# EAGLE design ipad3_lcd (EAGLE 6.2)
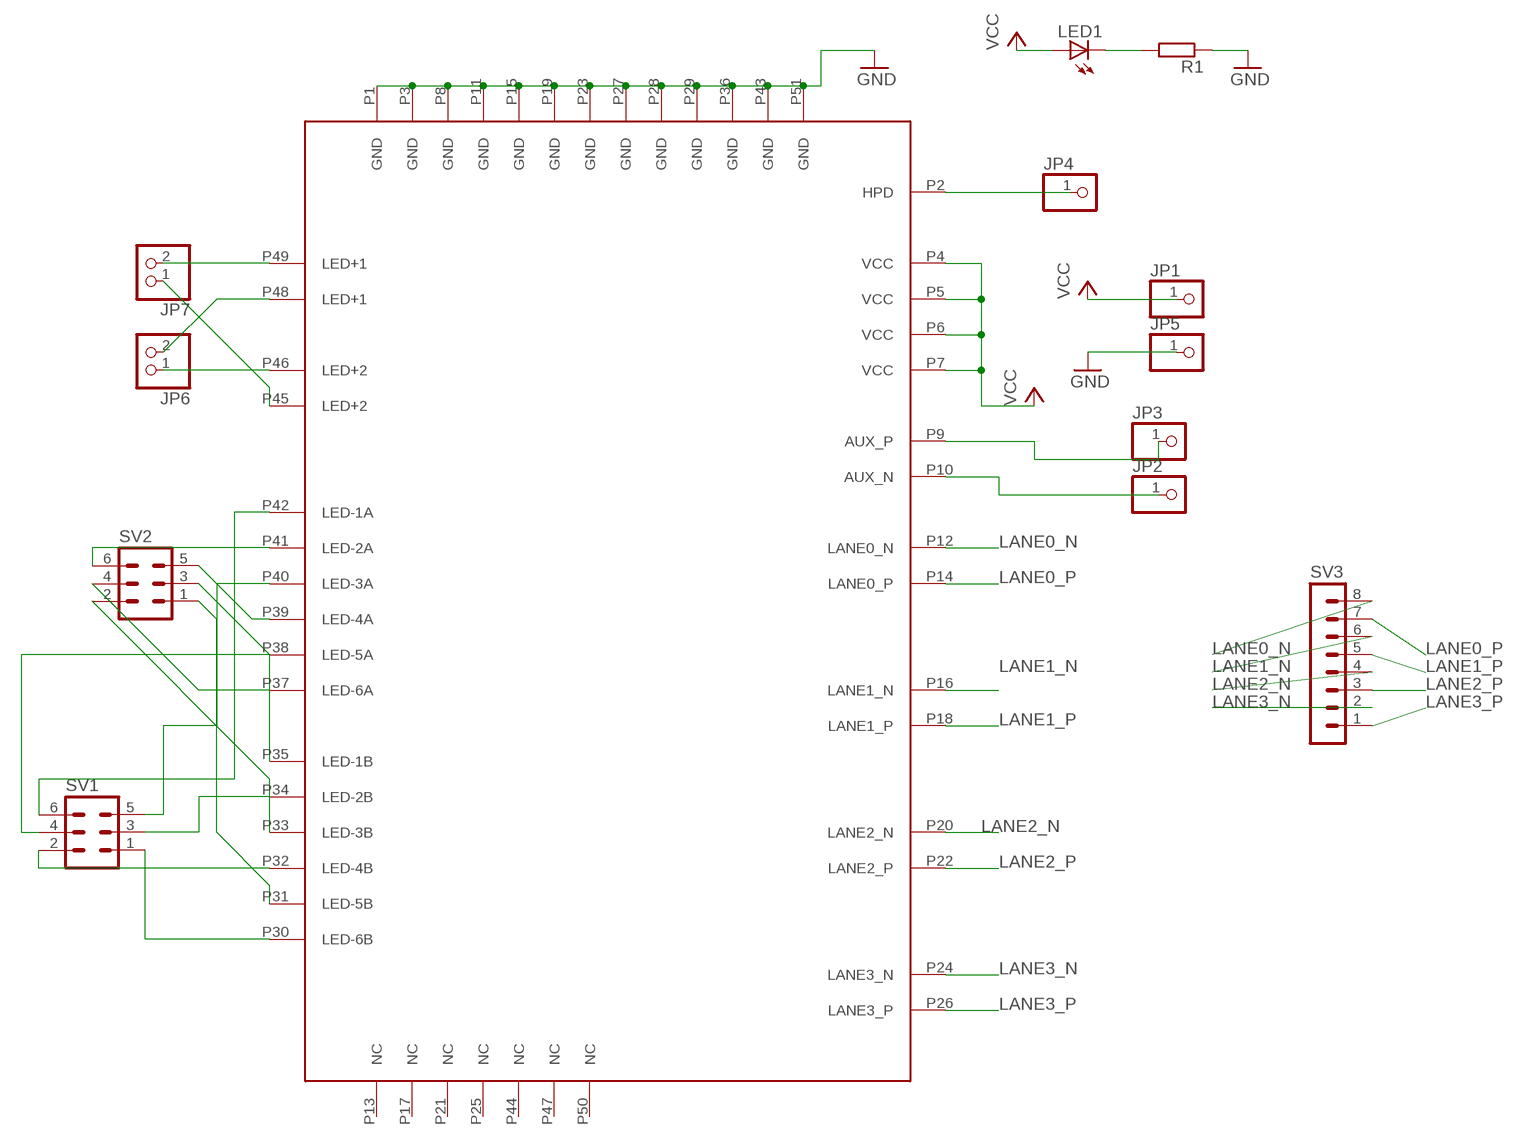
[diagram p0: schematic, sheet 1]

## Parts
JP1  PINHD-1X1  [1X01]
JP2  PINHD-1X1  [1X01]
JP3  PINHD-1X1  [1X01]
JP4  PINHD-1X1  [1X01]
JP5  PINHD-1X1  [1X01]
JP6  PINHD-1X2  [1X02]
JP7  PINHD-1X2  [1X02]
LED1  LEDCHIP-LED0805  [CHIP-LED0805]
R1  R-EU_M0805  [M0805]
SV1  MA03-2  [MA03-2]
SV2  MA03-2  [MA03-2]
SV3  MA08-1  [MA08-1]
U$1  IPAD3-CONN  [MOLEX502250-5191]

## Nets
AUX_N: JP2.1 U$1.P10(AUX_N)
AUX_P: JP3.1 U$1.P9(AUX_P)
GND: JP5.1 R1.1 U$1.P1(GND) U$1.P3(GND) U$1.P8(GND) U$1.P11(GND) U$1.P15(GND) U$1.P19(GND) U$1.P23(GND) U$1.P27(GND) U$1.P28(GND) U$1.P29(GND) U$1.P36(GND) U$1.P43(GND) U$1.P51(GND)
HPD: JP4.1 U$1.P2(HPD)
LANE0_N: SV3.8 U$1.P12(LANE0_N)
LANE0_P: SV3.7 U$1.P14(LANE0_P)
LANE1_N: SV3.6 U$1.P16(LANE1_N)
LANE1_P: SV3.5 U$1.P18(LANE1_P)
LANE2_N: SV3.4 U$1.P20(LANE2_N)
LANE2_P: SV3.3 U$1.P22(LANE2_P)
LANE3_N: SV3.2 U$1.P24(LANE3_N)
LANE3_P: SV3.1 U$1.P26(LANE3_P)
N$1: SV1.1 U$1.P30(LED-6B)
N$2: SV1.2 U$1.P32(LED-4B)
N$3: LED1.C R1.2
N$4: SV1.3 U$1.P34(LED-2B)
N$5: SV1.4 U$1.P38(LED-5A)
N$6: SV1.5 U$1.P40(LED-3A)
N$7: SV1.6 U$1.P42(LED-1A)
N$8: SV2.6 U$1.P41(LED-2A)
N$9: SV2.5 U$1.P39(LED-4A)
N$10: SV2.4 U$1.P37(LED-6A)
N$11: SV2.3 U$1.P35(LED-1B)
N$12: SV2.2 U$1.P33(LED-3B)
N$13: SV2.1 U$1.P31(LED-5B)
N$14: JP6.1 U$1.P46(LED+2)
N$15: JP6.2 U$1.P48(LED+1)
N$16: JP7.1 U$1.P45(LED+2)
N$17: JP7.2 U$1.P49(LED+1)
VCC: JP1.1 LED1.A U$1.P4(VCC) U$1.P5(VCC) U$1.P6(VCC) U$1.P7(VCC)
Unconnected: U$1.P13(NC) U$1.P17(NC) U$1.P21(NC) U$1.P25(NC) U$1.P44(NC) U$1.P47(NC) U$1.P50(NC)

## Library data of the parts
JP1-JP5 = pinhead:PINHD-1X1: PIN HEADER
JP6 JP7 = pinhead:PINHD-1X2: PIN HEADER
LED1 = led:LED: LED OSRAM: - CHIPLED LG R971, LG N971, LY N971, LG Q971, LY Q971, LO R971, LY R971 LH N974, LH R974 LS Q976, LO Q976, LY Q976 LO Q996 - Hyper CHIPLED LW Q18S LB Q993, LB Q99A, LB R99A - SideLED LS A670, LO A670, LY A670, LG A670, LP A670 LB A673, LV A673, LT A673, LW A673 LH A674 LY A675 LS A676, LA A676, LO A676, LY A676, LW A676 LS A679, LY A679, LG A679 - Hyper Micro SIDELED® LS Y876, LA Y876, LO Y876, LY Y876 LT Y87S - SmartLED LW L88C, LW L88S LB L89C, LB L89S, LG L890 LS L89K, LO L89K, LY L89K LS L896, LA L896, LO L896, LY L896 - TOPLED LS T670, LO T670, LY T670, LG T670, LP T670 LSG T670, LSP T670, LSY T670, LOP T670, LYG T670 LG T671, LOG T671, LSG T671 LB T673, LV T673, LT T673, LW T673 LH T674 LS T676, LA T676, LO T676, LY T676, LB T676, LH T676, LSB T676, LW T676 LB T67C, LV T67C, LT T67C, LS T67K, LO T67K, LY T67K, LW E67C LS E67B, LA E67B, LO E67B, LY E67B, LB E67C, LV E67C, LT E67C LW T67C LS T679, LY T679, LG T679 LS T770, LO T770, LY T770, LG T770, LP T770 LB T773, LV T773, LT T773, LW T773 LH T774 LS E675, LA E675, LY E675, LS T675 LS T776, LA T776, LO T776, LY T776, LB T776 LHGB T686 LT T68C, LB T68C - Hyper Mini TOPLED® LB M676 - Mini TOPLED Santana® LG M470 LS M47K, LO M47K, LY M47K Source: http://www.osram.convergy.de LUXEON: - LUMILED® LXK2-PW12-R00, LXK2-PW12-S00, LXK2-PW14-U00, LXK2-PW14-V00 LXK2-PM12-R00, LXK2-PM12-S00, LXK2-PM14-U00 LXK2-PE12-Q00, LXK2-PE12-R00, LXK2-PE12-S00, LXK2-PE14-T00, LXK2-PE14-U00 LXK2-PB12-K00, LXK2-PB12-L00, LXK2-PB12-M00, LXK2-PB14-N00, LXK2-PB14-P00, LXK2-PB14-Q00 LXK2-PR12-L00, LXK2-PR12-M00, LXK2-PR14-Q00, LXK2-PR14-R00 LXK2-PD12-Q00, LXK2-PD12-R00, LXK2-PD12-S00 LXK2-PH12-R00, LXK2-PH12-S00 LXK2-PL12-P00, LXK2-PL12-Q00, LXK2-PL12-R00 Source: www.luxeon.com KINGBRIGHT: KA-3528ASYC Source: www.kingbright.com
R1 = rcl:R-EU_: RESISTOR, European symbol
SV1 SV2 = con-lstb:MA03-2: PIN HEADER; OC_FARNELL: unknown; OC_NEWARK: unknown
SV3 = con-lstb:MA08-1: PIN HEADER; OC_FARNELL: unknown; OC_NEWARK: unknown
U$1 = con-ipad3:IPAD3-CONN

## Board
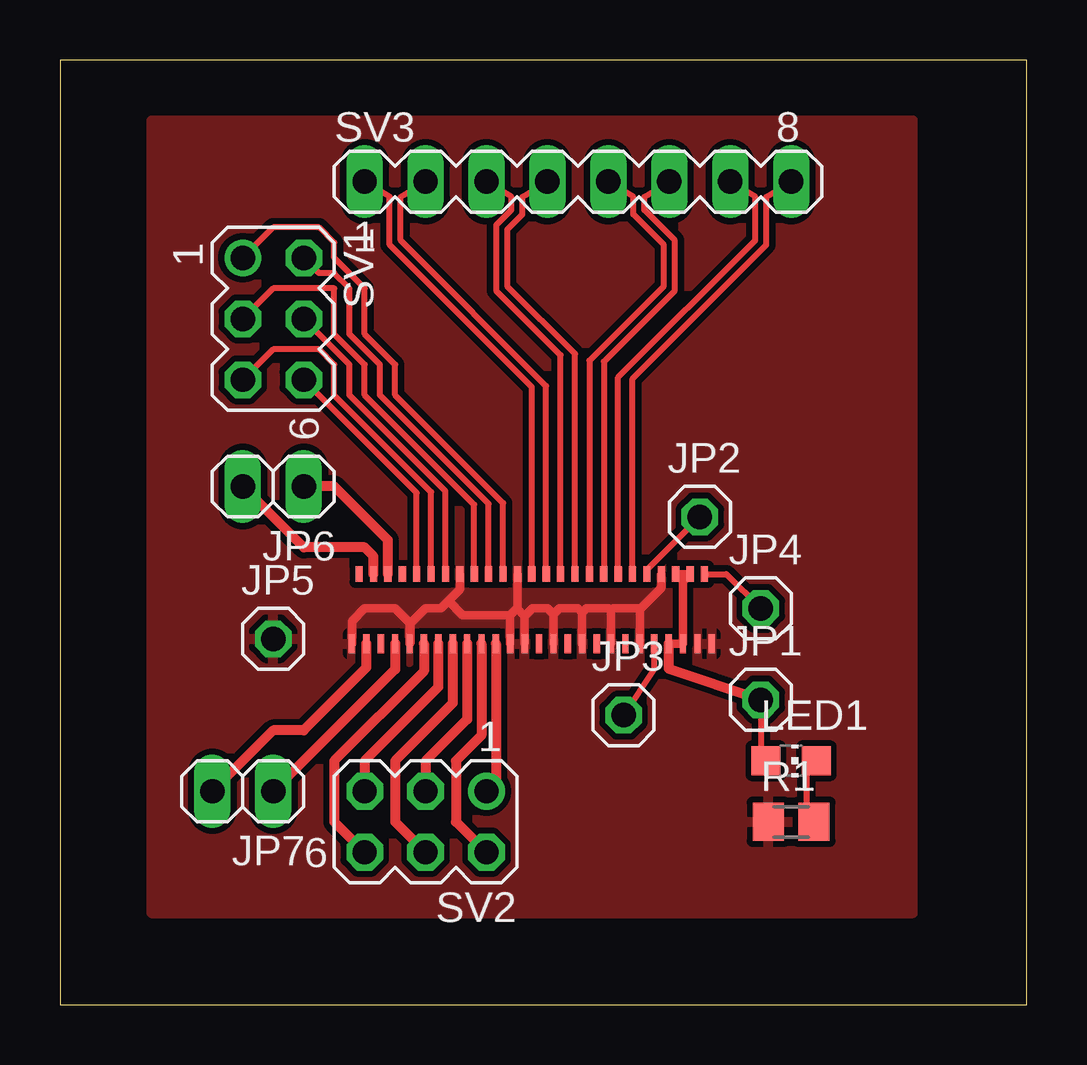
[diagram p1: board, top side]

Size 40.31 x 39.36 mm. Coordinates in mm from the lower left corner, seen from the top.
Outline: 0,0 40.31,0 40.31,39.36 0,39.36 0,0
Copper layers (1*16): Top 0.035mm / dielectric 1.5mm / Bottom 0.035mm
Design rules: minimum track width 10mil, minimum drill 24mil, track to track 8mil, track to pad 8mil, pad to pad 8mil, via to via 8mil, smd to smd 8mil, copper to edge 40mil, drill to drill 8mil, minimum pad ring 10mil, minimum via ring 8mil, stop-mask expansion 4mil, vias tented up to drill 0mil, thermal gap 10mil

### Footprints (pad centres in the part's own frame; a part is rotated, then mirrored left to right if it is on the bottom)
1X01 = drill 1.016 octagon: 1 0,0
1X02 = drill 1.016 long: 1 -1.27,0; 2 1.27,0
CHIP-LED0805 = smd 1.2 x 1.2: A 0,-1.05; C 0,1.05
M0805 = smd 1.3 x 1.6: 1 -0.95,0; 2 0.95,0
MA03-2 = drill 1.016: 1 -2.54,-1.27 | drill 1.016 octagon: 2 -2.54,1.27; 3 0,-1.27; 4 0,1.27; 5 2.54,-1.27; 6 2.54,1.27
MA08-1 = drill 1.016 long: 1 -8.89,0; 2 -6.35,0; 3 -3.81,0; 4 -1.27,0; 5 1.27,0; 6 3.81,0; 7 6.35,0; 8 8.89,0
MOLEX502250-5191 = smd 0.26 x 0.8: P1 13.2,-0.2; P3 12.6,-0.2; P5 12,-0.2; P7 11.4,-0.2; P9 10.8,-0.2; P11 10.2,-0.2; P13 9.6,-0.2; P15 9,-0.2; P17 8.4,-0.2; P19 7.8,-0.2; P21 7.2,-0.2; P23 6.6,-0.2; P25 6,-0.2; P27 5.4,-0.2; P29 4.8,-0.2; P31 4.2,-0.2; P33 3.6,-0.2; P35 3,-0.2; P37 2.4,-0.2; P39 1.8,-0.2; P41 1.2,-0.2; P43 0.6,-0.2; P45 0,-0.2; P47 -0.6,-0.2; P49 -1.2,-0.2; P51 -1.8,-0.2 | smd 0.3 x 0.65: P2 12.9,2.7; P4 12.3,2.7; P6 11.7,2.7; P8 11.1,2.7; P10 10.5,2.7; P12 9.9,2.7; P14 9.3,2.7; P16 8.7,2.7; P18 8.1,2.7; P20 7.5,2.7; P22 6.9,2.7; P24 6.3,2.7; P26 5.7,2.7; P28 5.1,2.7; P30 4.5,2.7; P32 3.9,2.7; P34 3.3,2.7; P36 2.7,2.7; P38 2.1,2.7; P40 1.5,2.7; P42 0.9,2.7; P44 0.3,2.7; P46 -0.3,2.7; P48 -0.9,2.7; P50 -1.5,2.7

### Placement (x,y rotation side)
JP1  29.21,12.7 0 top
JP2  26.67,20.32 0 top
JP3  23.5,12.07 0 top
JP4  29.21,16.51 0 top
JP5  8.89,15.24 0 top
JP6  8.89,21.59 180 top
JP7  7.62,8.89 180 top
LED1  30.48,10.16 270 top
R1  30.48,7.62 0 top
SV1  8.89,28.57 270 top
SV2  15.24,7.62 180 top
SV3  21.59,34.29 0 top
U$1  13.97,15.24 0 top

### Tracks (layer width: path | path; a pad name or v marks a point on that pad's centre or on a via)
AUX_N
  Top 0.254: U$1.P10 24.47,18.12 JP2.1
AUX_P
  Top 0.254: U$1.P9 24.77,13.97 JP3.1
GND
  Top 0.356: U$1.P51 12.17,15.98 12.7,16.51 13.97,16.51 14.61,15.88 14.61,15.07 U$1.P43 14.57,15.84 15.24,16.51 15.88,16.51 16.19,16.83 | 16.19,16.83 16.67,17.31 U$1.P36 | U$1.P28 19.07,16.53 19.05,16.51 | U$1.P29 18.77,16.23 | 18.77,16.23 19.05,16.51 | U$1.P27 19.37,16.19 | 19.37,16.19 19.05,16.51 | U$1.P23 20.57,16.26 | 20.57,16.26 20.32,16.51 19.69,16.51 19.37,16.19 | U$1.P19 21.77,16.33 | 21.77,16.33 21.59,16.51 20.82,16.51 20.57,16.26 | U$1.P15 22.97,16.4 | 22.97,16.4 22.86,16.51 21.95,16.51 21.77,16.33 | U$1.P11 24.17,16.47 | 24.17,16.47 24.13,16.51 23.08,16.51 22.97,16.4 | U$1.P8 25.07,17.37 24.17,16.47 | 18.77,16.23 16.79,16.23 16.19,16.83
  pour Top (isolate 0.254): 3.81,3.81 35.56,3.81 35.56,36.83 3.81,36.83
HPD
  Top 0.254: U$1.P2 27.78,17.94 JP4.1
LANE0_N
  Top 0.254: U$1.P12 23.87,26.09 29.44,31.65 29.44,33.66 SV3.8
LANE0_P
  Top 0.254: U$1.P14 23.27,26.13 28.98,31.85 28.98,33.66 SV3.7
LANE1_N
  Top 0.254: U$1.P16 22.67,26.79 25.63,29.75 25.63,31.85 24.36,33.11 24.36,33.66 SV3.6
LANE1_P
  Top 0.254: U$1.P18 22.07,26.84 25.17,29.94 25.17,31.65 23.9,32.92 23.9,33.66 SV3.5
LANE2_N
  Top 0.254: U$1.P20 21.47,27.11 18.64,29.94 18.64,32.29 19.28,32.92 19.28,33.66 SV3.4
LANE2_P
  Top 0.254: U$1.P22 20.87,27.07 18.19,29.75 18.19,32.48 18.82,33.11 18.82,33.66 SV3.3
LANE3_N
  Top 0.254: U$1.P24 20.27,25.77 14.2,31.85 14.2,33.66 SV3.2
LANE3_P
  Top 0.254: U$1.P26 19.67,25.73 13.74,31.65 13.74,33.66 SV3.1
N$1
  Top 0.254: U$1.P30 18.47,20.9 13.97,25.4 13.97,26.67 12.7,27.94 12.7,29.85 11.43,31.11 11.43,31.75 10.8,32.39 8.89,32.39 SV1.1
N$2
  Top 0.254: U$1.P32 17.87,20.86 13.34,25.4 13.34,26.67 12.07,27.94 12.07,29.85 11.43,30.48 10.8,30.48 SV1.2
N$3
  Top 0.254: R1.2 31.11,7.62 31.11,10.16 LED1.C
N$4
  Top 0.254: U$1.P34 17.27,20.83 12.7,25.4 12.7,26.67 11.43,27.94 11.43,29.85 8.89,29.85 SV1.3
N$5
  Top 0.254: U$1.P38 16.07,21.39 12.07,25.4 12.07,26.67 SV1.4
N$6
  Top 0.254: U$1.P40 15.47,21.36 11.43,25.4 11.43,26.67 10.8,27.31 8.89,27.31 SV1.5
N$7
  Top 0.254: U$1.P42 14.87,21.32 SV1.6
N$8
  Top 0.406: U$1.P41 15.17,13.9 11.43,10.16 11.43,7.62 SV2.6
N$9
  Top 0.406: U$1.P39 15.77,13.23 12.7,10.16 SV2.5
N$10
  Top 0.406: U$1.P37 16.37,12.56 13.97,10.16 13.97,7.62 SV2.4
N$11
  Top 0.406: U$1.P35 16.97,11.89 15.24,10.16 SV2.3
N$12
  Top 0.406: U$1.P33 17.57,11.22 16.51,10.16 16.51,7.62 SV2.2
N$13
  Top 0.406: U$1.P31 18.17,9.28 SV2.1
N$14
  Top 0.406: U$1.P46 13.67,19.35 11.43,21.59 JP6.1
N$15
  Top 0.406: U$1.P48 13.07,18.68 12.7,19.05 10.16,19.05 JP6.2
N$16
  Top 0.406: U$1.P45 13.97,13.97 JP7.1
N$17
  Top 0.406: U$1.P49 12.77,14.04 10.16,11.43 8.89,11.43 JP7.2
VCC
  Top 0.254: JP1.1 29.21,10.16 LED1.A
  Top 0.356: U$1.P7 U$1.P5 25.97,17.64 U$1.P4 U$1.P6
  Top 0.406: U$1.P7 25.37,14 JP1.1